# EAGLE design CC1120-chunk (EAGLE 6.5.0)
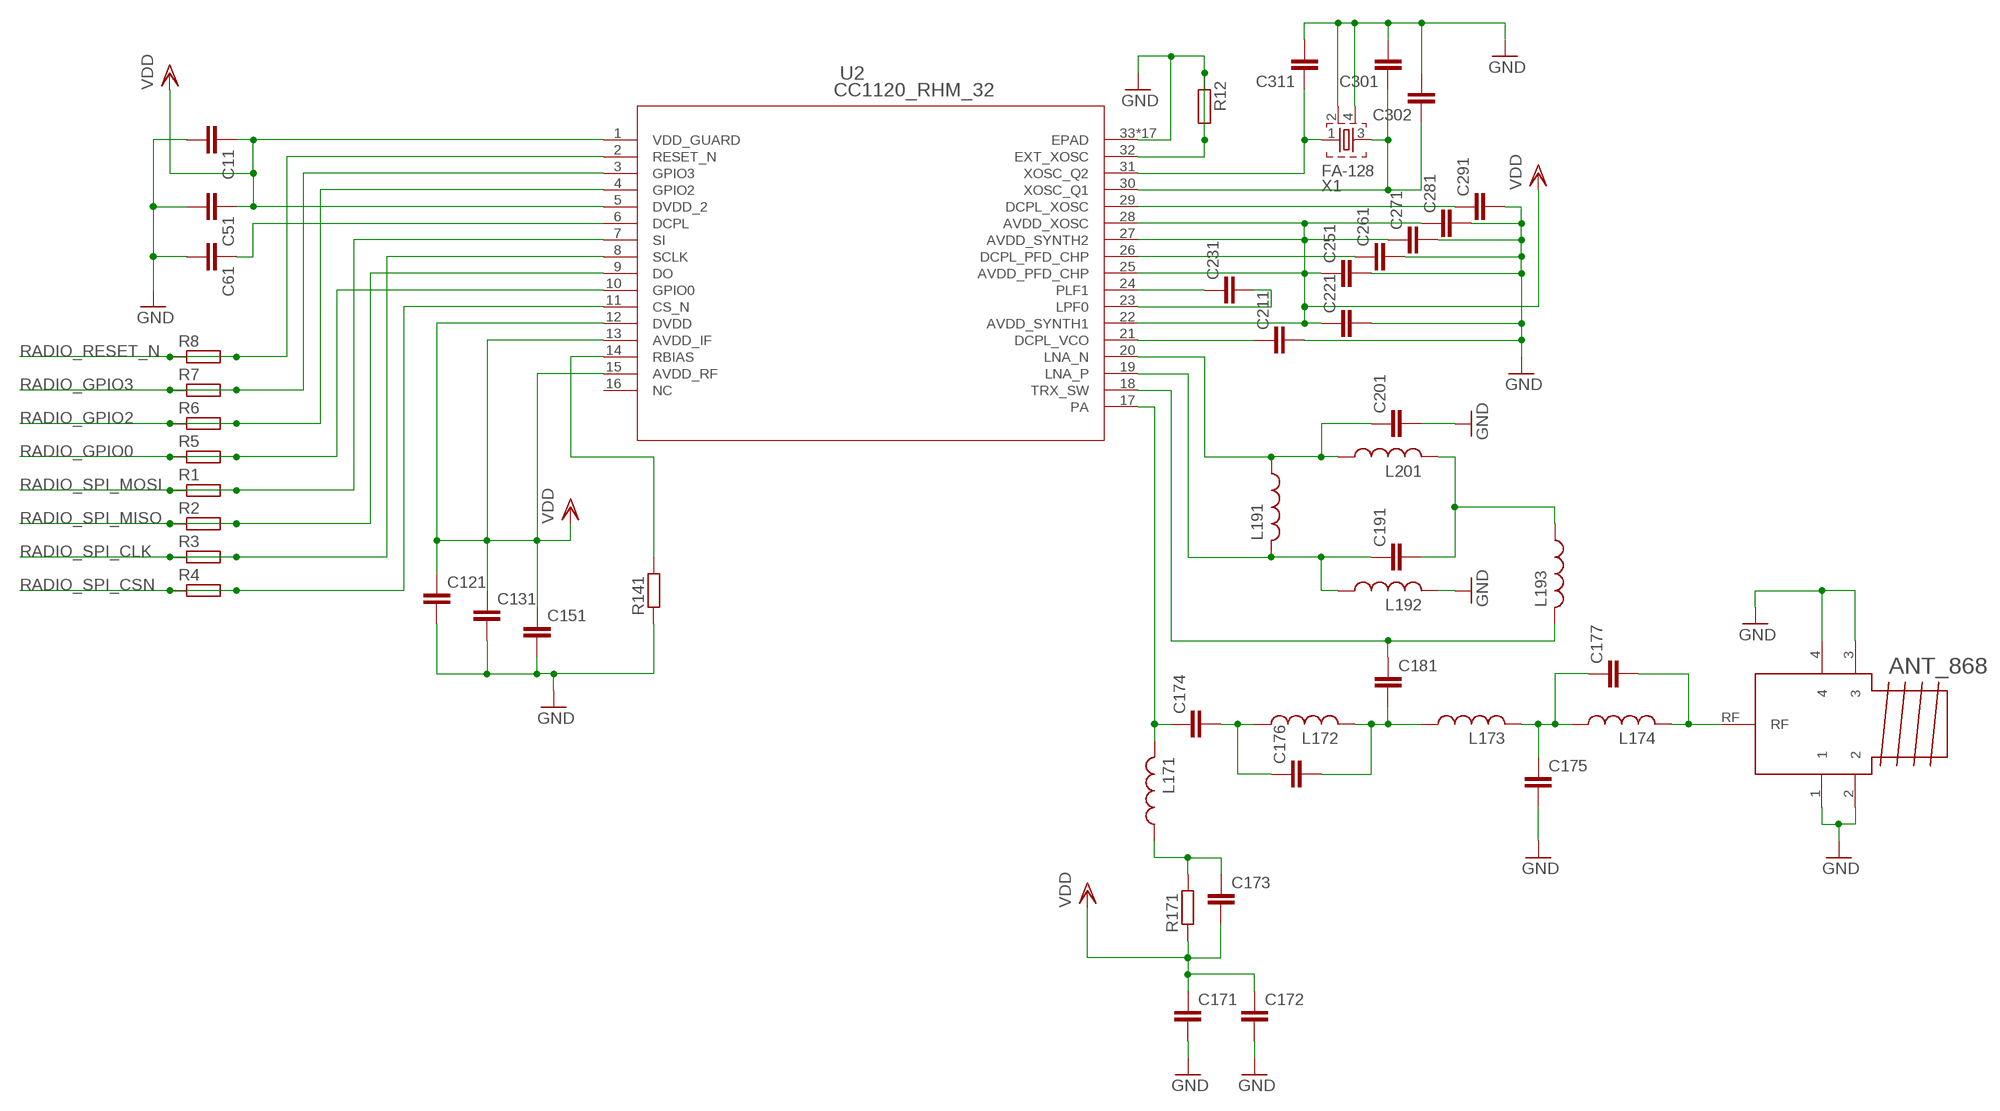
[diagram p0: schematic, sheet 1]

## Parts
ANT_868  SMA  [JOHNSON_142-0701-806]
C11  C_EU  [C0402_SMALL]
C51  C_EU  [C0402_SMALL]
C61  C_EU  [C0402_SMALL]
C121  C_EU  [C0402_SMALL]
C131  C_EU  [C0402_SMALL]
C151  C_EU  [C0402_SMALL]
C171  C_EU  [C0402_SMALL]
C172  C_EU  [C0402_SMALL]
C173  C_EU  [C0402_SMALL]
C174  C_EU  [C0402_SMALL]
C175  C_EU  [C0402_SMALL]
C176  C_EU  [C0402_SMALL]
C177  C_EU  [C0402_SMALL]
C181  C_EU  [C0402_SMALL]
C191  C_EU  [C0402_SMALL]
C201  C_EU  [C0402_SMALL]
C211  C_EU  [C0402_SMALL]
C221  C_EU  [C0402_SMALL]
C231  C_EU  [C0402_SMALL]
C251  C_EU  [C0402_SMALL]
C261  C_EU  [C0402_SMALL]
C271  C_EU  [C0402_SMALL]
C281  C_EU  [C0402_SMALL]
C291  C_EU  [C0402_SMALL]
C301  C_EU  [C0402_SMALL]
C302  C_EU  [C0402_SMALL]
C311  C_EU  [C0402_SMALL]
L171  L_US  [C0402_SMALL]
L172  L_US  [C0402_SMALL]
L173  L_US  [C0402_SMALL]
L174  L_US  [C0402_SMALL]
L191  L_US  [C0402_SMALL]
L192  L_US  [C0402_SMALL]
L193  L_US  [C0402_SMALL]
L201  L_US  [C0402_SMALL]
R1  R-EU_R0603  [R0603]
R2  R-EU_R0603  [R0603]
R3  R-EU_R0603  [R0603]
R4  R-EU_R0603  [R0603]
R5  R-EU_R0603  [R0603]
R6  R-EU_R0603  [R0603]
R7  R-EU_R0603  [R0603]
R8  R-EU_R0603  [R0603]
R12  R_EU  [C0402_SMALL]
R141  R_EU  [C0402_SMALL]
R171  R_EU  [C0402_SMALL]
U2  CC1120_RHM_32  [RHM32_3P7X3P7]
X1  FA-128  [FA-128]

## Nets
GND: ANT_868.1 ANT_868.2 ANT_868.3 ANT_868.4 C11.2 C51.2 C61.2 C121.2 C131.2 C151.2 C171.2 C172.2 C175.2 C201.2 C211.2 C221.2 C251.2 C261.2 C271.2 C281.2 C291.2 C301.2 C302.2 C311.2 L192.2 R12.1 R12.2 R141.1 U2.32(EXT_XOSC) U2.33(EPAD) U2.V(EPAD) U2.V_2(EPAD) U2.V_3(EPAD) U2.V_4(EPAD) U2.V_5(EPAD) U2.V_6(EPAD) U2.V_7(EPAD) U2.V_8(EPAD) U2.V_9(EPAD) U2.V_10(EPAD) U2.V_11(EPAD) U2.V_12(EPAD) U2.V_13(EPAD) U2.V_14(EPAD) U2.V_15(EPAD) U2.V_16(EPAD) X1.2 X1.4
N$1: C231.1 U2.24(PLF1)
N$2: C231.2 U2.23(LPF0)
N$3: C211.1 U2.21(DCPL_VCO)
N$4: C61.1 U2.6(DCPL)
N$5: C261.1 U2.26(DCPL_PFD_CHP)
N$6: C311.1 U2.31(XOSC_Q2) X1.1
N$7: C301.1 C302.1 U2.30(XOSC_Q1) X1.3
N$8: C291.1 U2.29(DCPL_XOSC)
N$9: C201.1 L191.1 L201.1 U2.20(LNA_N)
N$10: C191.1 L191.2 L192.1 U2.19(LNA_P)
N$11: C191.2 L193.1 L201.2
N$12: C181.1 L193.2 U2.18(TRX_SW)
N$13: R141.2 U2.14(RBIAS)
N$14: C174.1 L171.2 U2.17(PA)
N$15: C174.2 C176.1 L172.1
N$16: C176.2 C181.2 L172.2 L173.1
N$17: C175.1 C177.1 L173.2 L174.1
N$18: ANT_868.RF C177.2 L174.2
N$19: C173.1 L171.1 R171.2
RADIO_GPIO0: R5.1 R5.2 U2.10(GPIO0)
RADIO_GPIO2: R6.1 R6.2 U2.4(GPIO2)
RADIO_GPIO3: R7.1 R7.2 U2.3(GPIO3)
RADIO_RESET_N: R8.1 R8.2 U2.2(RESET_N)
RADIO_SPI_CLK: R3.1 R3.2 U2.8(SCLK)
RADIO_SPI_CSN: R4.1 R4.2 U2.11(CS_N)
RADIO_SPI_MISO: R2.1 R2.2 U2.9(DO)
RADIO_SPI_MOSI: R1.1 R1.2 U2.7(SI)
VDD: C11.1 C51.1 C121.1 C131.1 C151.1 C171.1 C172.1 C173.2 C221.1 C251.1 C271.1 C281.1 R171.1 U2.1(VDD_GUARD) U2.5(DVDD_2) U2.12(DVDD) U2.13(AVDD_IF) U2.15(AVDD_RF) U2.22(AVDD_SYNTH1) U2.25(AVDD_PFD_CHP) U2.27(AVDD_SYNTH2) U2.28(AVDD_XOSC)
Unconnected: U2.16(NC)

## Library data of the parts
ANT_868 = CC11x:SMA
C11 C51 C61 C121 C131 C151 C171-C177 C181 C191 C201 C211 C221 C231 C251 C261 C271 C281 C291 C301 C302 C311 = CC11x:C_EU
L171-L174 L191-L193 L201 = CC11x:L_US
R1-R8 = rcl:R-EU_: RESISTOR, European symbol
R12 R141 R171 = CC11x:R_EU
U2 = CC11x:CC1120_RHM_32; DATASHEETURL: http://www.ti.com/lit/gpn/CC1120; DESCRIPTION: High Performance RF Transceiver for Narrowband Systems; FAMILY_NAME: SUB-1 GHZ; GENERIC_PART_NUMBER: CC1120; INDUSTRY_STD_PKG_TYPE: QFN; MANUFACTURER: Texas Instruments; PACKAGE_DESIGNATOR: RHM; PIN_COUNT: 32
X1 = crystal:FA-: MHz RANGE CRYSTAL UNIT Source: Epson Toyocom

## Board
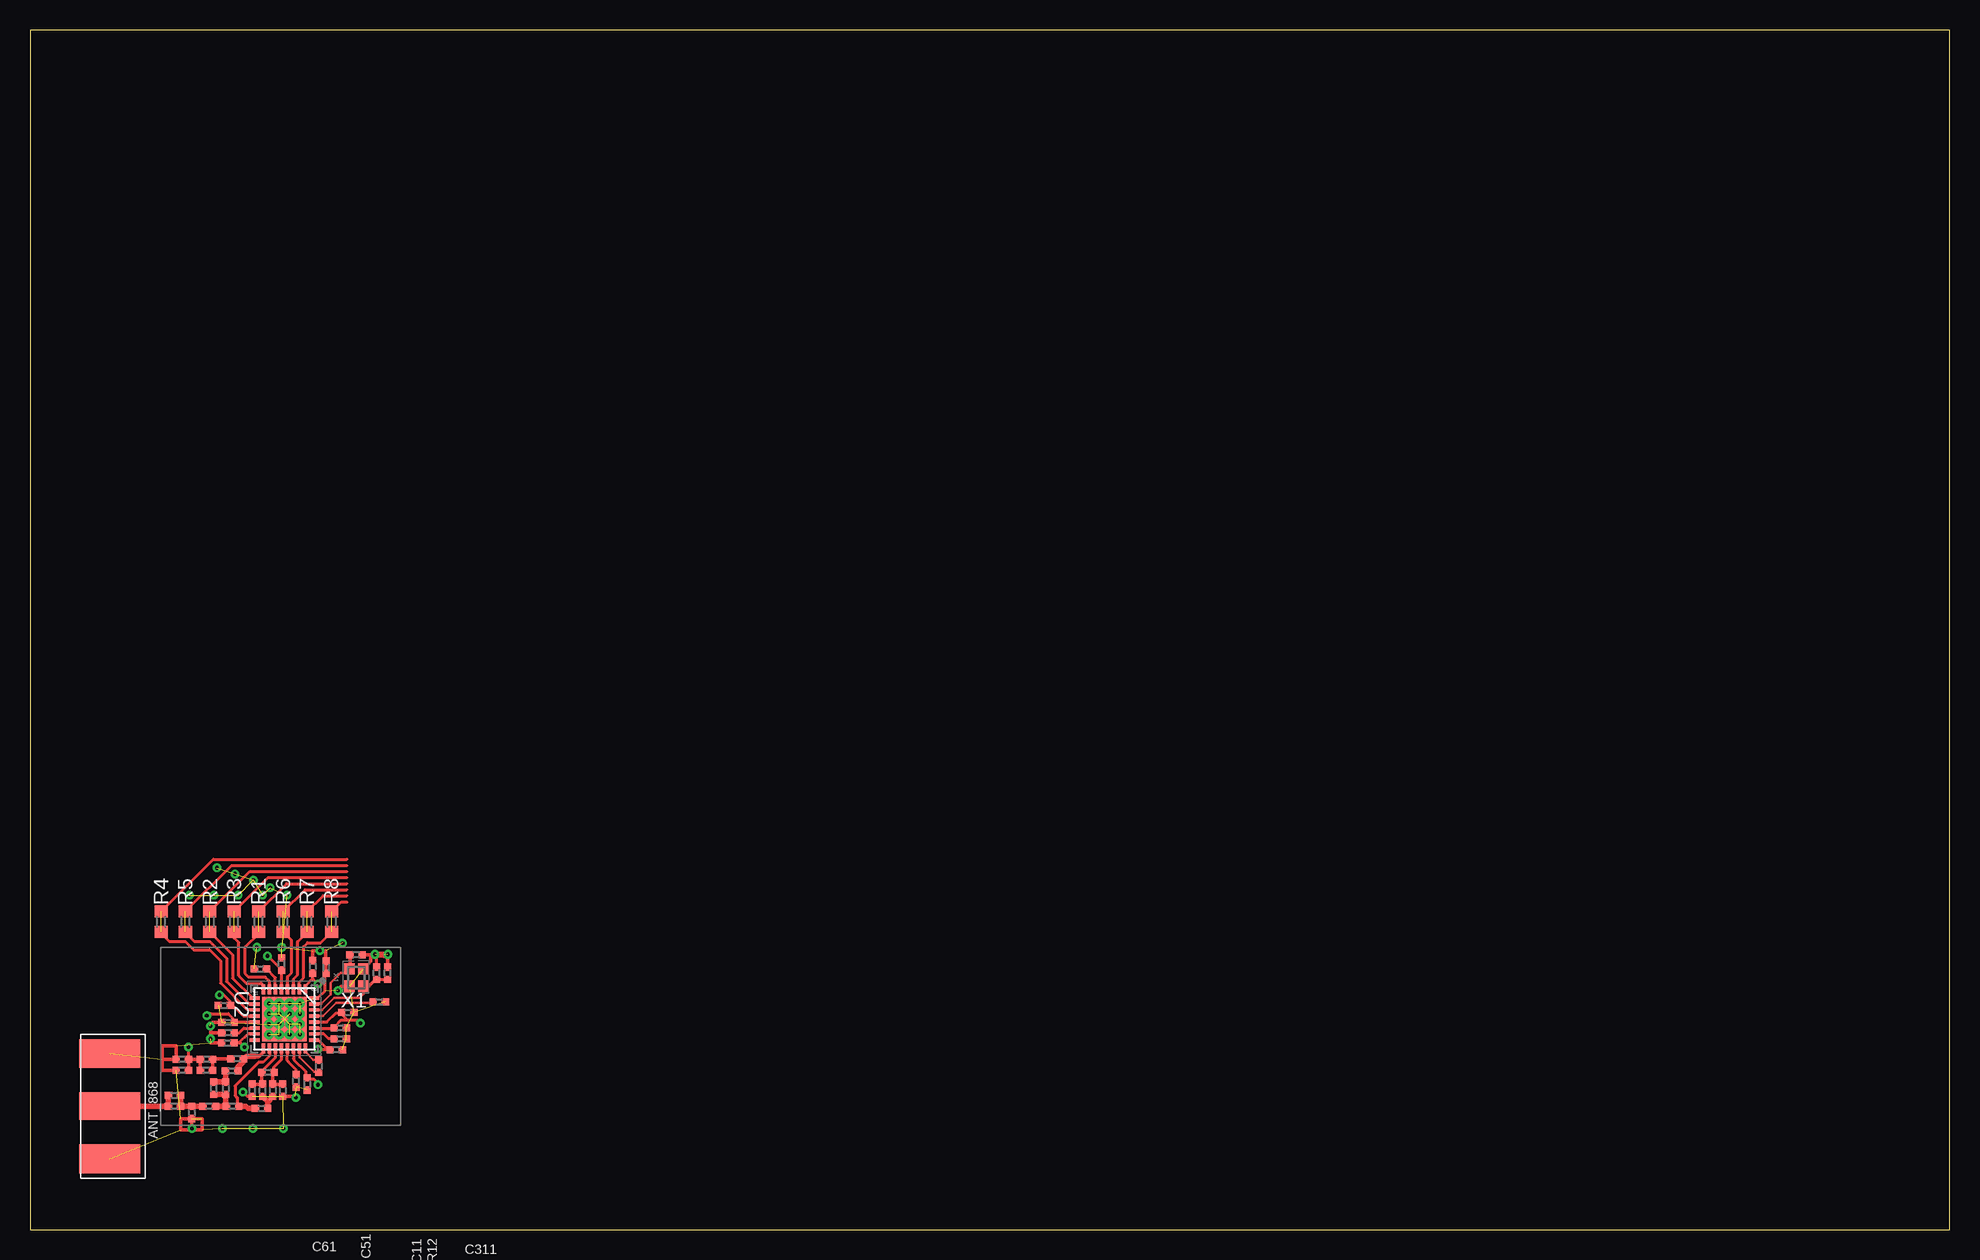
[diagram p1: board, top side]
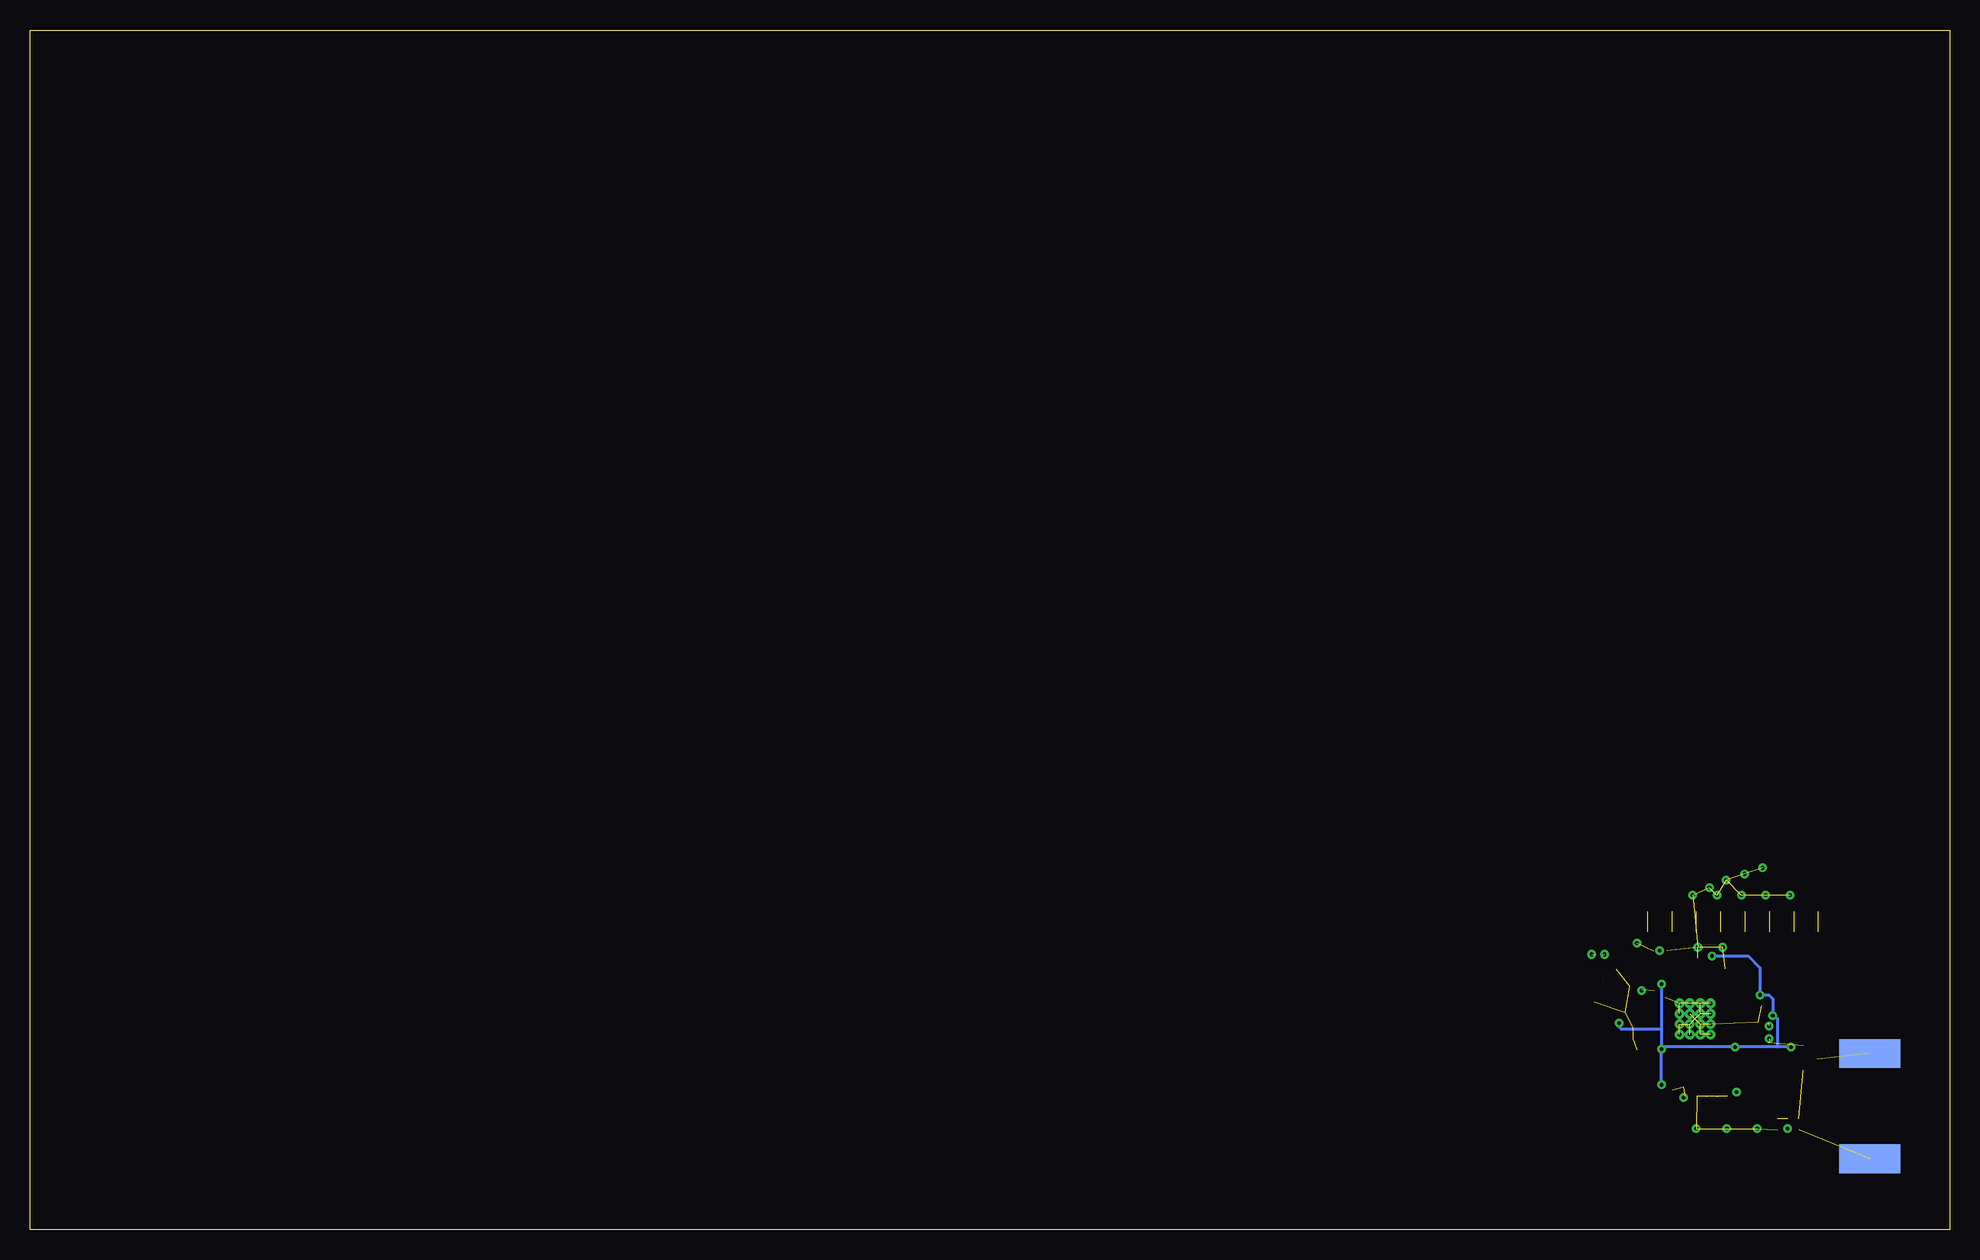
[diagram p2: board, bottom side, seen from below]

Size 160 x 100 mm. Coordinates in mm from the lower left corner, seen from the top.
Outline: 0,0 160,0 160,100 0,100 0,0
Copper layers (1*16): Top 0.035mm / dielectric 1.5mm / Bottom 0.035mm
Design rules "default": minimum track width 10mil, minimum drill 24mil, track to track 8mil, track to pad 8mil, pad to pad 8mil, via to via 8mil, smd to smd 8mil, copper to edge 40mil, drill to drill 8mil, minimum pad ring 10mil, minimum via ring 8mil, stop-mask expansion 4mil, vias tented up to drill 0mil, thermal gap 10mil
tRestrict: area 11.8,8.9 to 21.4,14.6; area 15.6,14.6 to 18.2,17.7; area 9.2,8.9 to 11.8,11.7; area 23.1,19.1 to 24.9,21.3; area 25.4,19.5 to 28.1,23.2; area 23.1,20.9 to 25.4,22.7; area 28.1,19.5 to 30.2,22.3

### Footprints (pad centres in the part's own frame; a part is rotated, then mirrored left to right if it is on the bottom)
JOHNSON_142-0701-806 = smd 2.413 x 5.08: 1 -4.381,-2.54; 2 4.381,-2.54 | smd 2.413 x 5.08 bottom: 3 4.381,-2.54; 4 -4.381,-2.54 | smd 2.286 x 5.08: RF 0,-2.54
C0402_SMALL = smd 0.61 x 0.584: 1 -0.536,0; 2 0.485,0
R0603 = smd 1 x 1.1: 1 -0.85,0; 2 0.85,0
RHM32_3P7X3P7 = smd 0.838 x 0.279: 1 -2.464,1.753; 2 -2.464,1.245; 3 -2.464,0.762; 4 -2.464,0.254; 5 -2.464,-0.254; 6 -2.464,-0.762; 7 -2.464,-1.245; 8 -2.464,-1.753; 17 2.464,-1.753; 18 2.464,-1.245; 19 2.464,-0.762; 20 2.464,-0.254; 21 2.464,0.254; 22 2.464,0.762; 23 2.464,1.245; 24 2.464,1.753 | smd 0.279 x 0.838: 9 -1.753,-2.464; 10 -1.245,-2.464; 11 -0.762,-2.464; 12 -0.254,-2.464; 13 0.254,-2.464; 14 0.762,-2.464; 15 1.245,-2.464; 16 1.753,-2.464; 25 1.753,2.464; 26 1.245,2.464; 27 0.762,2.464; 28 0.254,2.464; 29 -0.254,2.464; 30 -0.762,2.464; 31 -1.245,2.464; 32 -1.753,2.464 | smd 3.708 x 3.708: 33 0,0 | drill 0.305: V 1.295,1.295; V_2 -1.295,-0.432; V_3 -1.295,-1.295; V_4 -1.295,0.432; V_5 -1.295,1.295; V_6 -0.432,-1.295; V_7 -0.432,-0.432; V_8 -0.432,0.432; V_9 -0.432,1.295; V_10 0.432,-1.295; V_11 0.432,-0.432; V_12 0.432,0.457; V_13 0.432,1.295; V_14 1.295,-1.295; V_15 1.295,-0.432; V_16 1.295,0.432
FA-128 = smd 0.95 x 0.85: 1 -0.725,-0.575; 2 0.725,-0.575; 3 0.725,0.575; 4 -0.725,0.575

### Placement (x,y rotation side)
ANT_868  4.11,10.29 90 top
C11  23.57,21.92 90 top
C51  20.97,22.16 90 top
C61  19.18,21.72 180 top
C121  16.18,18.67 180 top
C131  16.48,17.27 180 top
C151  16.46,15.54 180 top
C171  12.67,13.28 180 top
C172  12.67,14.2 180 top
C173  14.68,13.28 180 top
C174  16.79,13.23 180 top
C175  13.49,9.73 270 top
C176  15.32,11.76 270 top
C177  12.01,11.18 180 top
C181  16.87,10.29 180 top
C191  19.38,11.58 270 top
C201  21.08,11.58 270 top
C211  22.17,12.37 270 top
C221  23.11,12.12 270 top
C231  24.08,13.59 270 top
C251  25.55,14.99 0 top
C261  25.88,15.9 0 top
C271  25.88,16.81 0 top
C281  26.52,18.08 0 top
C291  29.13,18.97 0 top
C301  28.88,21.39 90 top
C302  29.79,21.39 90 top
C311  27.2,22.91 0 top
L171  17.3,14.25 0 top
L172  16.33,11.76 270 top
L173  14.91,10.29 180 top
L174  12.01,10.29 180 top
L191  19.81,13.11 180 top
L192  18.52,11.58 270 top
L193  19.28,10.08 180 top
L201  20.24,11.58 270 top
R1  19.05,25.65 270 top
R2  14.99,25.65 270 top
R3  17.02,25.65 270 top
R4  10.93,25.66 270 top
R5  12.95,25.65 270 top
R6  21.11,25.65 270 top
R7  23.11,25.65 270 top
R8  25.15,25.65 270 top
R12  24.69,21.84 270 top
R141  16.54,16.41 0 top
R171  14.73,14.2 0 top
U2  21.21,17.55 270 top
X1  27.2,21.01 270 top

### Tracks (layer width: path | path; a pad name or v marks a point on that pad's centre or on a via)
GND  (via drill 0.3)  (58 unrouted)
  Top 0.254: 28.4,22.53 28.4,22.32 27.89,21.82 | 27.89,21.82 27.78,21.7 | X1.4 27.89,21.73 27.89,21.82 | X1.2 26.54,20.28 26.54,20.25 | 27.69,22.89 C311.2 | C301.2 28.88,22.89 | C302.2 29.79,22.05 29.82,22.07 | 24.64,21.33 24.59,21.33 24.59,19.91 23.98,19.29 U2.32 | 24.69,21.38 24.75,21.44 24.69,21.44 R12.1 | 24.69,21.38 24.64,21.33 | 24.69,21.33 24.64,21.33 | R12.2 24.69,21.38 | L192.2 18.11,11.1 v17.75,11.46
  Top 0.304: 26.63,20.25 26.54,20.25 25.92,20.25 25.63,19.96 | 29.82,21.84 29.82,22.07 29.82,22.58 29.52,22.89 29.49,22.89 | 28.4,22.89 27.69,22.89 | 28.4,22.89 28.4,22.53 | 28.55,22.89 28.4,22.89
  Top 0.305: C172.2 12.19,15.32 11.02,15.32 11.02,14.2 | 11.02,14.2 12.22,14.2 | C171.2 11.02,13.28 11.02,14.2 | C201.2 22.07,11.1 v22.17,11 | 14.35,9.24 14.35,8.33 12.57,8.33 12.57,9.25 14.35,9.25 | C175.2 v13.49,8.41 | C151.2 15.06,15.54 15.06,16.41 | 15.06,16.41 R141.1 | C131.2 15.21,17.27 15.21,17.17 15.06,17.17 15.06,16.41 | R12.1 24.66,22.41 24.66,23.24 v24.16,23.24 23.57,23.24 C11.2 | 25.63,19.96 25.63,19.91 v25.65,19.91
  Top 0.508: 29.49,22.89 28.88,22.89 28.55,22.89
  other vias: 16.03,8.41 18.57,8.41 21.11,8.41 20.98,23.52 15.04,15.9 15.04,16.97 28.75,22.94 29.82,22.94 18.9,23.52 13.28,27.86 15.57,30.15 15.32,27.86 17.35,27.86 19.38,27.86 21.41,27.86 17.09,29.64 18.62,29.13 20.02,28.5 26.06,23.88
N$1
  Top 0.203: 22.96,14.8 23.62,14.15 24.08,14.15
  Top 0.254: 22.96,14.8 22.96,14.81 U2.24 | 24.08,14.15 C231.1
N$2
  Top 0.203: 24.08,13.13 23.95,13.13 23.69,13.13 22.47,14.35 22.47,14.6 22.46,14.8
  Top 0.254: 22.46,14.8 22.45,14.81 U2.23 | C231.2 24.05,13.13 23.95,13.13
N$3
  Top 0.254: U2.21 21.46,14.75 21.46,14.1 21.54,14.02 21.54,13.97 22.17,13.33 C211.1 22.17,12.88
N$4
  Top 0.254: U2.6 20.45,20.99 C61.1
N$5
  Top 0.254: C261.1 24.89,15.9 24.49,16.31 U2.26
N$6
  Top 0.203: 26.63,21.7 26.63,21.39 25.88,21.39 25.07,20.57 25.07,19.61 24.27,18.81 24.23,18.81
  Top 0.254: 24.23,18.81 23.98,18.79 U2.31 | X1.1 26.67,21.73 26.67,21.79 | C311.1 26.67,22.89
  Top 0.304: 26.63,21.7 26.67,21.7 26.67,21.79 26.67,22.89
N$7  (1 unrouted)
  Top 0.203: 23.95,18.32 23.98,18.32 24.35,18.32 25.35,19.33 27.48,19.33 27.81,19.66 27.81,20.27
  Top 0.254: 23.95,18.32 U2.30 | X1.3 27.77,20.28 27.77,20.27 | C301.1 C302.1 | 28.8,20.85 C301.1
  Top 0.304: 28.8,20.85 28.22,20.27 27.81,20.27 27.77,20.27 27.75,20.28
N$8
  Top 0.203: 28.52,18.9 25.53,18.9 24.43,17.8 24,17.8 23.95,17.79 23.67,17.79
  Top 0.254: 28.52,18.9 28.57,18.95 28.6,18.95 C291.1 | 23.67,17.79 U2.29
N$9
  Top 0.254: U2.20 20.95,14.8 20.95,14.16 20.3,13.51 20.3,13.13 20.33,13.11 L191.1
  Top 0.305: C201.1 L201.1 20.24,13 L191.1
N$10
  Top 0.254: U2.19 20.45,14.8 20.45,14.32 19.41,13.28 19.41,13.19 L191.2
  Top 0.305: L192.1 C191.1 19.33,12.12 L191.2
N$11  (2 unrouted)
  Top 0.254: L193.1 19.81,10.13
  Top 0.457: 19.81,10.06 19.81,10.13 19.81,10.6 19.84,10.63 | 19.84,10.63 19.38,11.08 | 19.84,10.63 20.24,11.08
N$12
  Top 0.254: U2.18 19.96,14.48 19.43,13.95 19.08,13.95 17.09,11.96 17.09,11.18 17.27,11 17.27,10.49 17.45,10.31 | 17.42,10.29 C181.1 | L193.2 18.77,10.08
  Top 0.305: 17.45,10.31 17.43,10.31 C181.1
  Top 0.457: 17.42,10.29 17.98,10.29 18.19,10.08 18.77,10.08
N$13
  Top 0.254: R141.2 17.45,16.41 17.83,16.79 U2.14
N$14  (1 unrouted)
  Top 0.254: 19.44,14.78 19.46,14.8 U2.17 | L171.2 17.83,14.3 17.91,14.3
  Top 0.304: 19.44,14.78 19.1,14.44 19.01,14.44
  Top 0.355: 19.01,14.44 18.73,14.44
  Top 0.457: 18.73,14.44 18.05,14.44 17.91,14.3 17.87,14.26 17.77,14.26 17.77,13.99 17.31,13.53 17.31,13.25
N$15
  Top 0.457: C176.1 L172.1 16.3,12.32 C174.2
N$16
  Top 0.457: L173.1 C181.2 16.33,10.34 L172.2 C176.2
N$17
  Top 0.457: L173.2 14.4,10.26 C175.1 13.46,10.29 L174.1 C177.1
N$18
  Top 0.457: C177.2 L174.2 ANT_868.RF
N$19
  Top 0.305: L171.1 15.22,14.25 R171.2 C173.1
RADIO_GPIO0  (1 unrouted)
  Top 0.254: U2.10 18.26,18.8 16.38,20.68 16.38,22.61 14.99,24 13.69,24 12.95,24.74 R5.2 | R5.1 16.8,30.35 26.42,30.35
RADIO_GPIO2  (1 unrouted)
  Top 0.254: U2.4 21.46,21.08 21.79,21.41 21.79,24.12 R6.2 | R6.1 22.92,28.32 26.42,28.32
RADIO_GPIO3  (1 unrouted)
  Top 0.254: U2.3 21.97,20.88 22.3,21.21 22.3,23.99 R7.2 | R7.1 24.42,27.81 26.42,27.81
RADIO_RESET_N  (1 unrouted)
  Top 0.254: U2.2 22.45,20.62 22.81,20.98 22.81,23.57 23.14,23.9 24.24,23.9 R8.2 | R8.1 25.95,27.3 26.42,27.3
RADIO_SPI_CLK  (1 unrouted)
  Top 0.254: U2.8 19.46,20.32 19.25,20.52 18.03,20.52 17.4,21.16 17.4,23.93 17.02,24.31 R3.2 | R3.1 19.85,29.34 26.42,29.34
RADIO_SPI_CSN  (1 unrouted)
  Top 0.254: U2.11 18.11,18.31 15.88,20.55 15.88,22.4 14.96,23.32 13.64,23.32 12.95,24 11.61,24 10.93,24.68 R4.2 | R4.1 15.28,30.86 26.42,30.86
RADIO_SPI_MISO  (1 unrouted)
  Top 0.254: 18.44,19.3 U2.9 18.54,19.3 16.89,20.95 16.89,22.9 R2.2 | R2.1 18.33,29.84 26.42,29.84
RADIO_SPI_MOSI  (1 unrouted)
  Top 0.254: U2.7 19.96,20.68 19.61,21.03 18.24,21.03 17.91,21.36 17.91,23.52 19.05,24.66 R1.2 | R1.1 21.38,28.83 26.42,28.83
VDD  (via drill 0.3)
  Top 0.254: U2.22 21.97,14.76 21.96,14.75 21.97,14.28 21.97,14.24 22,14.21 22,14.16 22.99,13.17 22.99,12.62 23.02,12.65 C221.1 23.24,12.52 23.67,12.52 24,12.19 v24,12.06 | 17.41,15.54 18.19,16.32 18.44,16.32 18.44,16.31 U2.15 | 17.41,15.54 17.55,15.54 v17.88,15.21 | C151.1 17.02,15.54 | C151.1 16.94,15.54 | 17.41,15.54 C151.1 | U2.13 17.05,17.3 C131.1 17.07,17.27 17.07,17.45 16.54,17.98 15.09,17.98 14.94,17.83 v14.73,17.83 | U2.12 17.78,17.8 16.92,18.67 C121.1 16.71,18.97 16.13,19.56 v15.8,19.56 | U2.25 24.03,15.8 24.84,14.99 C251.1 24.97,15.04 v24,15.04 | U2.27 25.35,16.79 C271.1 25.35,16.87 25.91,17.42 26.49,17.42 | 26.49,17.42 25.98,17.93 25.98,18.06 | 26.49,17.42 27.3,17.42 v27.53,17.2 | 25.98,18.06 25.5,18.06 24.74,17.3 23.98,17.29 U2.28 | C281.1 25.98,18.06 | 23.57,20.92 23.57,20.9 v24,20.47 | 23.57,20.92 22.96,20.32 U2.1 | 23.57,20.92 C11.1 | U2.5 20.95,21.62 C51.1 20.97,21.64 v19.8,22.81 | C172.1 v13.21,15.21
  Top 0.305: C173.2 R171.1 C172.1 C171.1
  Bottom 0.254: v24,20.47 24,16.71 | 24,16.71 v24,15.04 | v27.53,17.2 27.53,16.89 27.36,16.71 24,16.71 | v24,12.06 v24,15.04 | v24,15.04 23.82,15.21 v17.88,15.21 14.35,15.21 | v13.21,15.21 14.35,15.21 | 14.35,15.21 14.35,17.58 14.61,17.83 v14.73,17.83 14.73,19.23 15.06,19.56 v15.8,19.56 15.8,21.82 16.79,22.81 v19.8,22.81